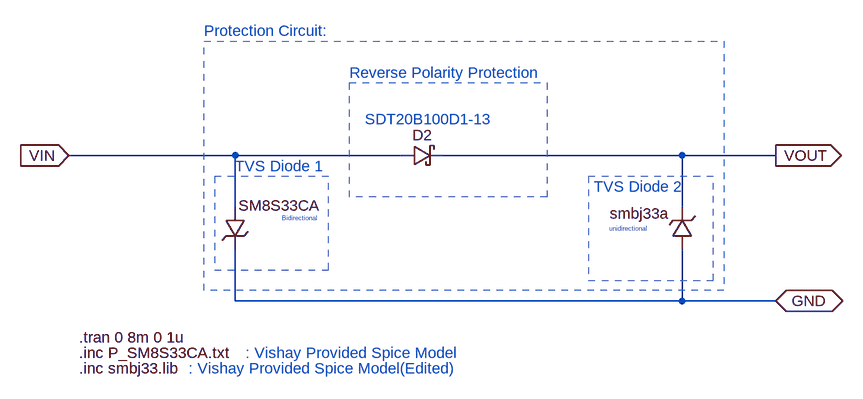
[diagram p0: schematic Protection.asc]
Protection.asc, the LTspice schematic file:
Version 4.1
SHEET 1 1000 680
WIRE -128 64 -384 64
WIRE 128 64 -128 64
WIRE 560 64 192 64
WIRE 704 64 560 64
WIRE -128 144 -128 64
WIRE 560 144 560 64
WIRE -128 288 -128 208
WIRE 560 288 560 208
WIRE 560 288 -128 288
WIRE 704 288 560 288
FLAG -384 64 VIN
IOPIN -384 64 In
FLAG 704 64 VOUT
IOPIN 704 64 Out
FLAG 704 288 GND
IOPIN 704 288 BiDir
SYMBOL TVSdiode -144 144 R0
WINDOW 0 24 -2 Invisible 2
WINDOW 3 21 -3 Left 2
SYMATTR InstName D1
SYMATTR Value SM8S33CA
SYMATTR Prefix X
SYMBOL TVSdiode 576 208 R180
WINDOW 0 24 65 Invisible 2
WINDOW 3 36 55 Left 2
SYMATTR InstName D3
SYMATTR Value smbj33a
SYMATTR Prefix X
SYMBOL schottky 128 80 R270
WINDOW 0 32 32 VTop 2
WINDOW 3 0 32 Invisible 2
SYMATTR InstName D2
SYMATTR Value PDS5100
SYMATTR Description Diode
SYMATTR Type diode
TEXT -368 344 Left 2 !.tran 0 8m 0 1u
TEXT -128 80 Left 2 ;TVS Diode 1
TEXT 48 -64 Left 2 ;Reverse Polarity Protection
TEXT -368 368 Left 2 !.inc P_SM8S33CA.txt
TEXT -112 368 Left 2 ;: Vishay Provided Spice Model
TEXT -176 -128 Left 2 ;Protection Circuit:
TEXT -368 392 Left 2 !.inc smbj33.lib
TEXT 424 112 Left 2 ;TVS Diode 2
TEXT -56 160 Left 0 ;Bidirectional
TEXT 448 176 Left 0 ;unidirectional
TEXT -200 392 Left 2 ;: Vishay Provided Spice Model(Edited)
TEXT 72 8 Left 2 ;SDT20B100D1-13
RECTANGLE Normal 48 -48 352 128 2
RECTANGLE Normal -160 240 16 96 2
RECTANGLE Normal 608 96 416 256 2
RECTANGLE Normal 624 272 -176 -112 1

The netlist it stands for:
* Protection.asc
X§D1 VIN GND SM8S33CA  ; pins + -
X§D3 GND VOUT smbj33a  ; pins + -
D2 VIN VOUT PDS5100
.model D D
.lib standard.dio
.tran 0 8m 0 1u
* TVS Diode 1
* Reverse Polarity Protection
.inc P_SM8S33CA.txt
* : Vishay Provided Spice Model
* Protection Circuit:
.inc smbj33.lib
* TVS Diode 2
* Bidirectional
* unidirectional
* : Vishay Provided Spice Model(Edited)
* SDT20B100D1-13
.backanno
.end